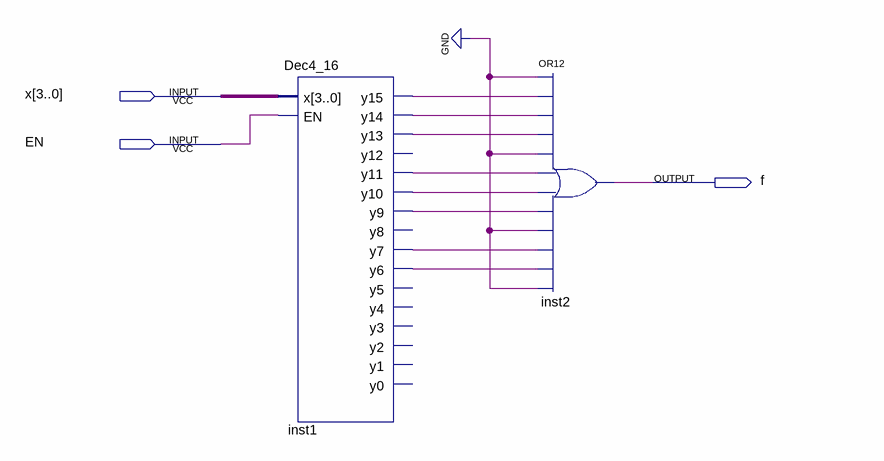
[diagram p0: schematic sheet]
// Quartus schematic DecoderDemo3.bdf as structural Verilog: 2 symbols, 3 pins
module DecoderDemo3 (
  input  [3:0] x,
  input  EN,
  output f
);

  wire inst1_y6, inst1_y7, inst1_y9, inst1_y10, inst1_y11, inst1_y13, inst1_y14, inst1_y15;

  Dec4_16 inst1 (
    .x(x), .EN(EN), .y15(inst1_y15), .y14(inst1_y14), .y13(inst1_y13), .y11(inst1_y11), .y10(inst1_y10),
    .y9(inst1_y9), .y7(inst1_y7), .y6(inst1_y6));  // open: y12, y8, y5, y4, y3, y2, y1, y0
  or inst2 (f, 1'b0, inst1_y15, inst1_y14, inst1_y13, 1'b0, inst1_y11, inst1_y10, inst1_y9, 1'b0, inst1_y7, inst1_y6, 1'b0);
endmodule
